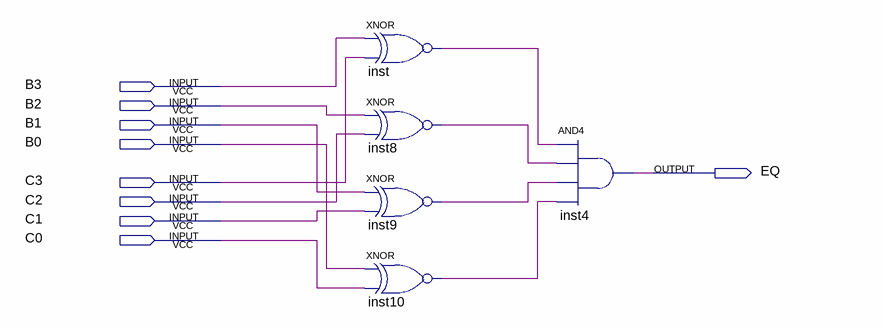
[diagram p0: schematic sheet]
// Quartus schematic Modulador.bdf as structural Verilog: 5 symbols, 9 pins
module Modulador (
  input  B3,
  input  B2,
  input  B1,
  input  B0,
  input  C3,
  input  C2,
  input  C1,
  input  C0,
  output EQ
);

  wire inst8_out, inst9_out, inst10_out, inst_out;

  xnor inst (inst_out, B3, C3);
  xnor inst8 (inst8_out, B2, C2);
  xnor inst9 (inst9_out, B1, C1);
  xnor inst10 (inst10_out, B0, C0);
  and inst4 (EQ, inst_out, inst8_out, inst9_out, inst10_out);
endmodule
